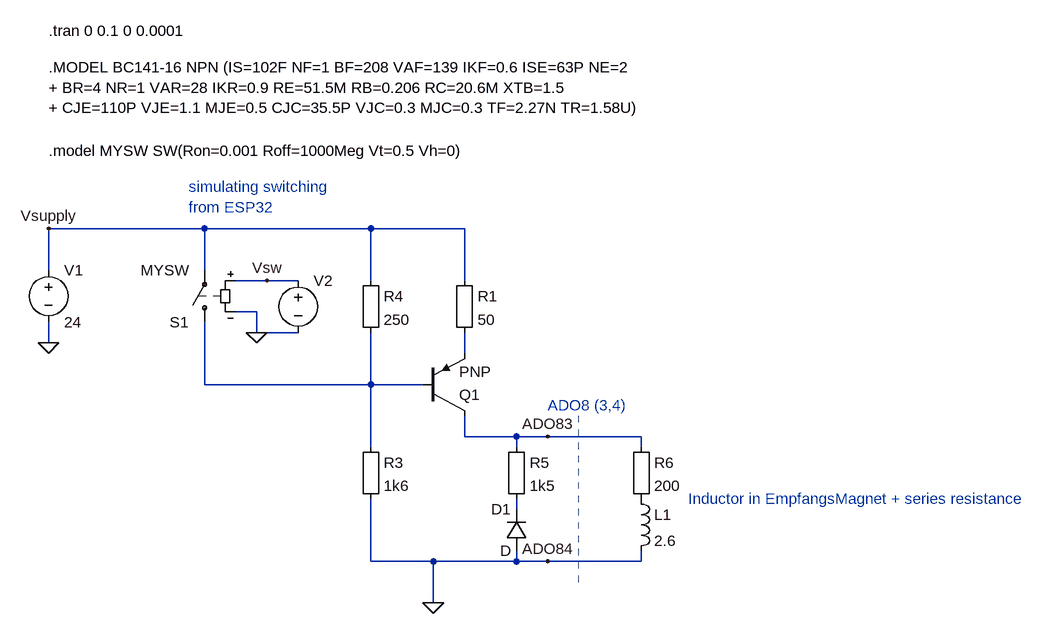
[diagram p0: schematic current_source.asc]
current_source.asc, the LTspice schematic file:
Version 4
SHEET 1 1692 916
WIRE 368 64 128 64
WIRE 624 64 368 64
WIRE 768 64 624 64
WIRE 128 128 128 64
WIRE 368 128 368 64
WIRE 464 144 416 144
WIRE 512 144 464 144
WIRE 624 144 624 64
WIRE 768 144 768 64
WIRE 448 192 416 192
WIRE 448 224 448 192
WIRE 512 224 448 224
WIRE 128 240 128 208
WIRE 768 256 768 224
WIRE 368 304 368 208
WIRE 624 304 624 224
WIRE 624 304 368 304
WIRE 704 304 624 304
WIRE 768 384 768 352
WIRE 848 384 768 384
WIRE 896 384 848 384
WIRE 1040 384 896 384
WIRE 624 400 624 304
WIRE 848 400 848 384
WIRE 1040 400 1040 384
WIRE 848 496 848 480
WIRE 624 576 624 480
WIRE 720 576 624 576
WIRE 848 576 848 560
WIRE 848 576 720 576
WIRE 896 576 848 576
WIRE 1040 576 1040 560
WIRE 1040 576 896 576
WIRE 720 640 720 576
FLAG 128 240 0
FLAG 448 224 0
FLAG 128 64 Vsupply
FLAG 464 144 Vsw
FLAG 720 640 0
FLAG 896 576 ADO84
FLAG 896 384 ADO83
SYMBOL voltage 128 112 R0
WINDOW 123 0 0 Left 0
WINDOW 39 0 0 Left 0
SYMATTR InstName V1
SYMATTR Value 24
SYMBOL sw 368 224 R180
SYMATTR InstName S1
SYMATTR Value MYSW
SYMBOL voltage 512 128 R0
WINDOW 3 24 96 Invisible 2
WINDOW 123 0 0 Left 0
WINDOW 39 0 0 Left 0
SYMATTR Value PWL(0 0.0 0.009 0 0.01 1 0.019 1 0.02 0 0.039 0 0.04 1 0.079 1 0.08 0)
SYMATTR InstName V2
SYMBOL ind 1024 464 R0
SYMATTR InstName L1
SYMATTR Value 2.6
SYMBOL Misc\\EuropeanResistor 752 128 R0
SYMATTR InstName R1
SYMATTR Value 50
SYMBOL Misc\\EuropeanResistor 608 384 R0
SYMATTR InstName R3
SYMATTR Value 1k6
SYMBOL Misc\\EuropeanResistor 608 128 R0
SYMATTR InstName R4
SYMATTR Value 250
SYMBOL diode 864 560 R180
WINDOW 0 24 64 Left 2
WINDOW 3 24 0 Left 2
SYMATTR InstName D1
SYMBOL Misc\\EuropeanResistor 832 384 R0
SYMATTR InstName R5
SYMATTR Value 1k5
SYMBOL Misc\\EuropeanResistor 1024 384 R0
SYMATTR InstName R6
SYMATTR Value 200
SYMBOL pnp2 704 352 M180
SYMATTR InstName Q1
TEXT 1112 480 Left 2 ;Inductor in EmpfangsMagnet + series resistance
TEXT 128 -240 Left 2 !.tran 0 0.1 0 0.0001
TEXT 128 -56 Left 2 !.model MYSW SW(Ron=0.001 Roff=1000Meg Vt=0.5 Vh=0)
TEXT 344 0 Left 2 ;simulating switching\nfrom ESP32
TEXT 896 336 Left 2 ;ADO8 (3,4)
TEXT 128 -184 Left 2 !.MODEL BC141-16 NPN (IS=102F NF=1 BF=208 VAF=139 IKF=0.6 ISE=63P NE=2\n+ BR=4 NR=1 VAR=28 IKR=0.9 RE=51.5M RB=0.206 RC=20.6M XTB=1.5\n+ CJE=110P VJE=1.1 MJE=0.5 CJC=35.5P VJC=0.3 MJC=0.3 TF=2.27N TR=1.58U)
LINE Normal 944 608 944 352 2
LINE Normal 944 608 944 608 2
LINE Normal 944 608 944 608 2

The netlist it stands for:
* current_source.asc
V1 Vsupply 0 24
S1 N002 Vsupply Vsw 0 MYSW
V2 Vsw 0 PWL(0 0.0 0.009 0 0.01 1 0.019 1 0.02 0 0.039 0 0.04 1 0.079 1 0.08 0)
L1 P001 0 2.6
R1 Vsupply N001 50
R3 N002 0 1k6
R4 Vsupply N002 250
D1 0 N003 D
R5 ADO83 N003 1k5
R6 ADO83 P001 200
Q1 ADO83 N002 N001 0 PNP
.model D D
.lib standard.dio
.model NPN NPN
.model PNP PNP
.lib standard.bjt
* Inductor in EmpfangsMagnet + series resistance
.tran 0 0.1 0 0.0001
.model MYSW SW(Ron=0.001 Roff=1000Meg Vt=0.5 Vh=0)
* simulating switching
* from ESP32
* ADO8 (3,4)
.MODEL BC141-16 NPN (IS=102F NF=1 BF=208 VAF=139 IKF=0.6 ISE=63P NE=2
+ BR=4 NR=1 VAR=28 IKR=0.9 RE=51.5M RB=0.206 RC=20.6M XTB=1.5
+ CJE=110P VJE=1.1 MJE=0.5 CJC=35.5P VJC=0.3 MJC=0.3 TF=2.27N TR=1.58U)
.backanno
.end